# EAGLE design thermometre-v3-main (EAGLE 6.1)
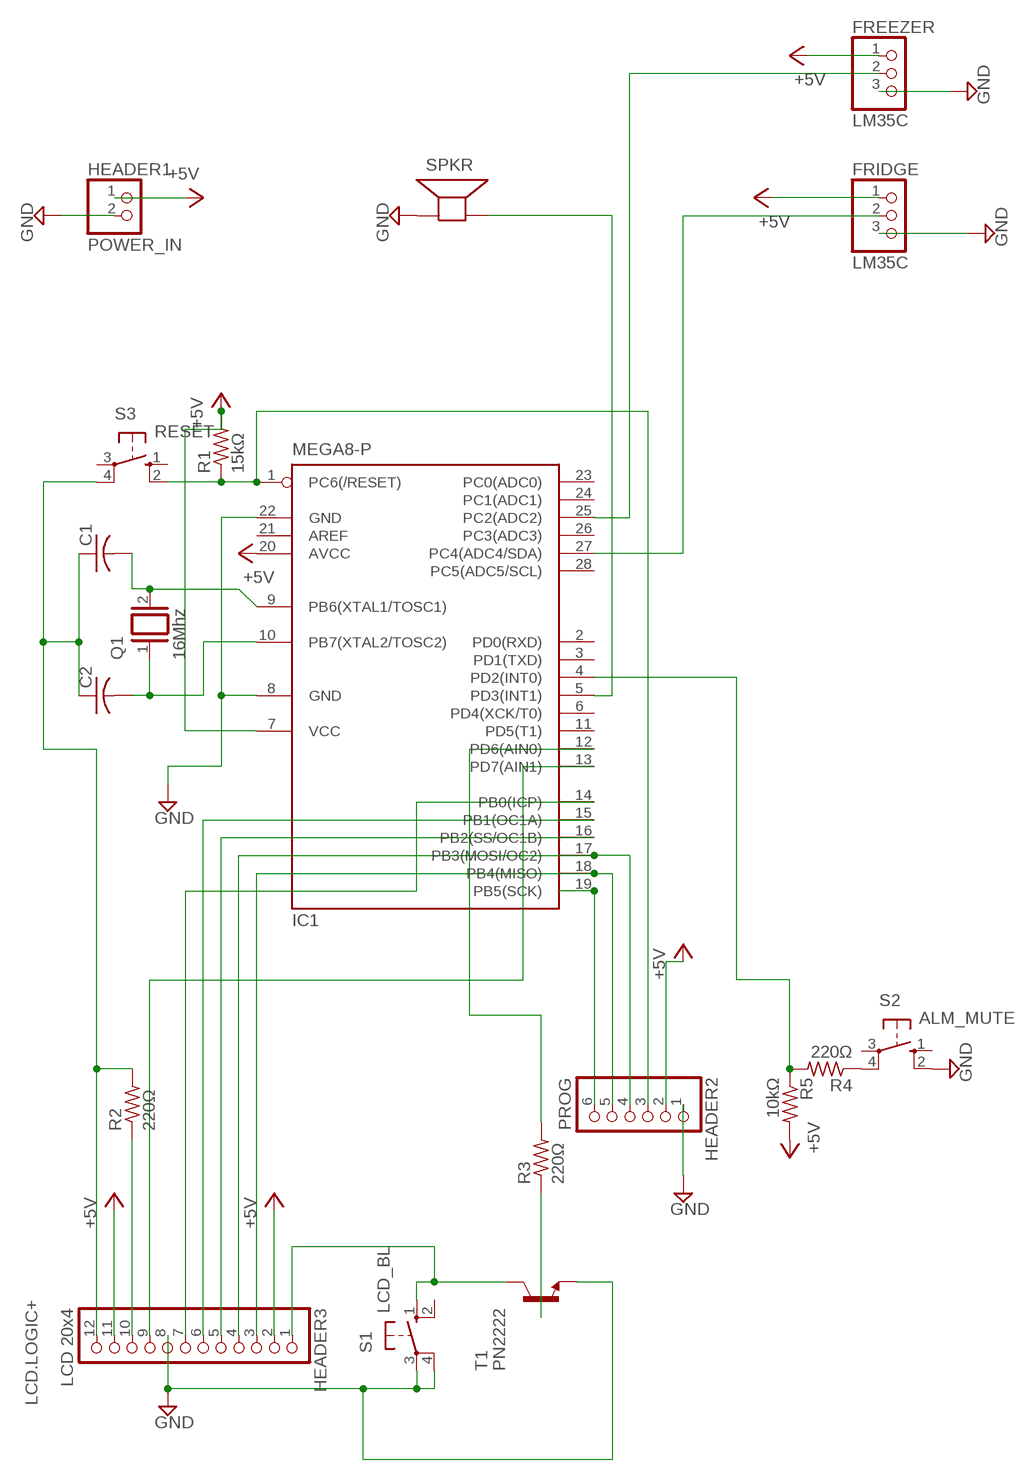
[diagram p0: schematic, sheet 1]

## Parts
C1  C-USC0805  [C0805]
C2  C-USC0805  [C0805]
FREEZER  LM35C  PINHD-1X3  [1X03]
FRIDGE  LM35C  PINHD-1X3  [1X03]
HEADER1  POWER_IN  PINHD-1X2  [1X02]
HEADER2  PROG  PINHD-1X6  [1X06]
HEADER3  LCD 20x4  PINHD-1X12  [1X12]
IC1  MEGA8-P  [DIL28-3]
Q1  16Mhz  XTAL/S  [QS]
R1  15kΩ  R-US_R0805  [R0805]
R2  220Ω  R-US_R0805  [R0805]
R3  220Ω  R-US_R0805  [R0805]
R4  220Ω  R-US_R0805  [R0805]
R5  10kΩ  R-US_R0805  [R0805]
S1  LCD_BL  10-XX  [B3F-10XX]
S2  ALM_MUTE  10-XX  [B3F-10XX]
S3  RESET  10-XX  [B3F-10XX]
SPKR  SPEAKER/AL60P  [AL60P]
T1  PN2222  BC547A-NPN-TO92-CBE  [TO92-CBE]

## Nets
+5V: FREEZER.1 FRIDGE.1 HEADER1.1 HEADER2.2 HEADER3.2 IC1.7(VCC) IC1.20(AVCC) R1.2 R5.2
GND: FREEZER.3 FRIDGE.3 HEADER1.2 HEADER2.1 HEADER3.8 IC1.8(GND) IC1.22(GND) S1.3(P) S1.4(P1) S2.2(S1) SPKR.1(+) T1.E
LCD.BL+: HEADER2.5 HEADER3.3 IC1.18(PB4(MISO))
LCD.BL-: HEADER3.1 S1.1(S) T1.C
LCD.CONTRAST: HEADER3.10 R2.1
LCD.LOGIC+: C1.1 C2.1 HEADER3.12 R2.2 S3.4(P1)
LCD.LOGIC-: HEADER3.11 ; supply symbol labelled +5V
N$1: C1.2 IC1.9(PB6(XTAL1/TOSC1)) Q1.2
N$2: C2.2 IC1.10(PB7(XTAL2/TOSC2)) Q1.1
N$4: HEADER2.3 IC1.1(PC6(/RESET)) R1.1 S3.2(S1)
N$5: HEADER2.6 IC1.19(PB5(SCK))
N$7: HEADER2.4 HEADER3.4 IC1.17(PB3(MOSI/OC2))
N$8: R4.1 S2.4(P1)
N$10: HEADER3.7 IC1.14(PB0(ICP))
N$13: HEADER3.9 IC1.13(PD7(AIN1))
N$14: HEADER3.6 IC1.15(PB1(OC1A))
N$15: HEADER3.5 IC1.16(PB2(SS/OC1B))
N$18: IC1.12(PD6(AIN0)) R3.2
N$20: R3.1 T1.B
N$22: FRIDGE.2 IC1.27(PC4(ADC4/SDA))
N$23: IC1.5(PD3(INT1)) SPKR.2(-)
N$25: IC1.4(PD2(INT0)) R4.2 R5.1
N$28: FREEZER.2 IC1.25(PC2(ADC2))
Unconnected: IC1.2(PD0(RXD)) IC1.3(PD1(TXD)) IC1.6(PD4(XCK/T0)) IC1.11(PD5(T1)) IC1.21(AREF) IC1.23(PC0(ADC0)) IC1.24(PC1(ADC1)) IC1.26(PC3(ADC3)) IC1.28(PC5(ADC5/SCL)) S1.2(S1) S2.1(S) S2.3(P) S3.1(S) S3.3(P)

## Library data of the parts
C1 C2 = rcl:C-US: CAPACITOR, American symbol
FREEZER FRIDGE = pinhead:PINHD-1X3: PIN HEADER
HEADER1 = pinhead:PINHD-1X2: PIN HEADER
HEADER2 = pinhead:PINHD-1X6: PIN HEADER
HEADER3 = pinhead:PINHD-1X12: PIN HEADER
IC1 = atmel:MEGA8-P: MICROCONTROLLER 8 Kbytes FLASH, 1 kbytes SRAM, 512 bytes EEPROM, USART, 4-channel 10 bit ADC, 2-channel 8 bit ADC Pin compatible with Atmega48, ATMega88, ATMega168 Source: avr.lbr; OC_FARNELL: unknown; OC_NEWARK: unknown
Q1 = special:XTAL/S: CRYSTAL
R1 R4 R5 = rcl:R-US_: RESISTOR, American symbol
R2 R3 = resistor:R-US_: RESISTOR, American symbol
S1-S3 = switch-omron:10-XX: OMRON SWITCH; MPN: B3F-1000; OC_FARNELL: 176432; OC_NEWARK: 36M3542
SPKR = adafruit:SPEAKER: SPEAKER Source: Buerklin Added PS12 (for part # PS1240 piezo) http://www.ladyada.net/library/pcb/eaglelibrary.html
T1 = transistor:*-NPN-: NPN Transistror BF959 corrected 2008.03.06

## Board
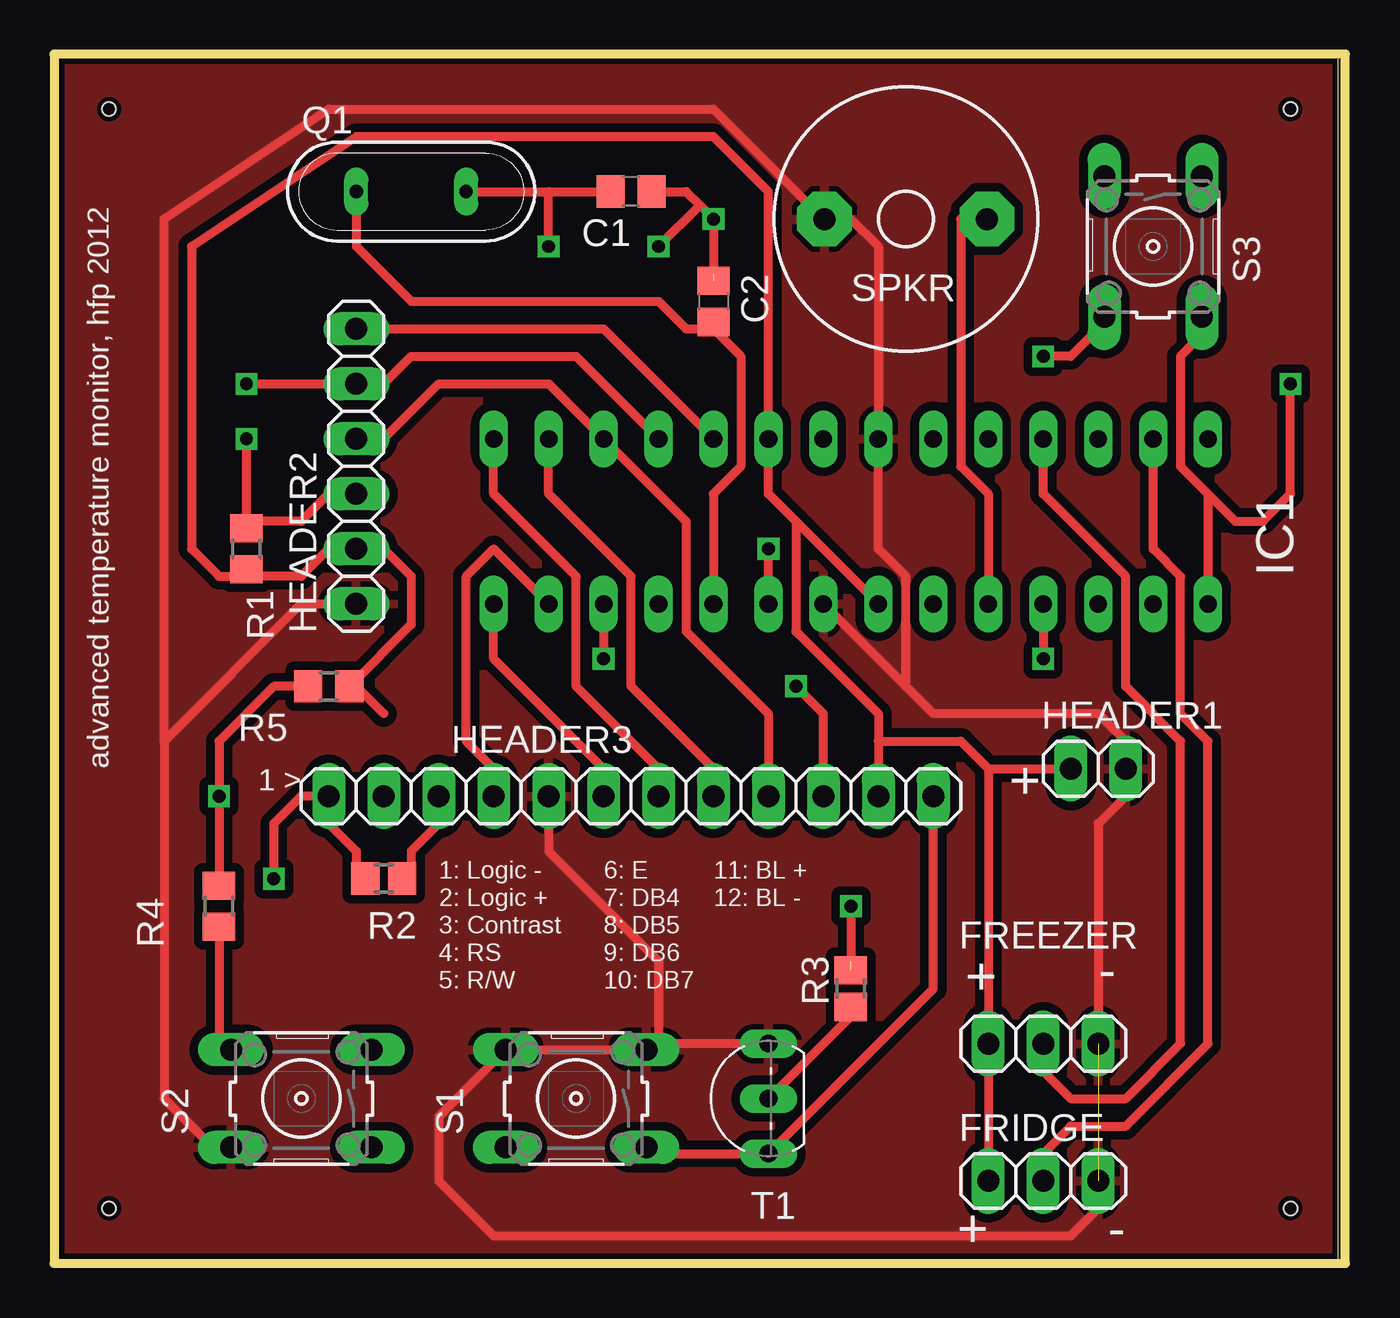
[diagram p1: board, top side]
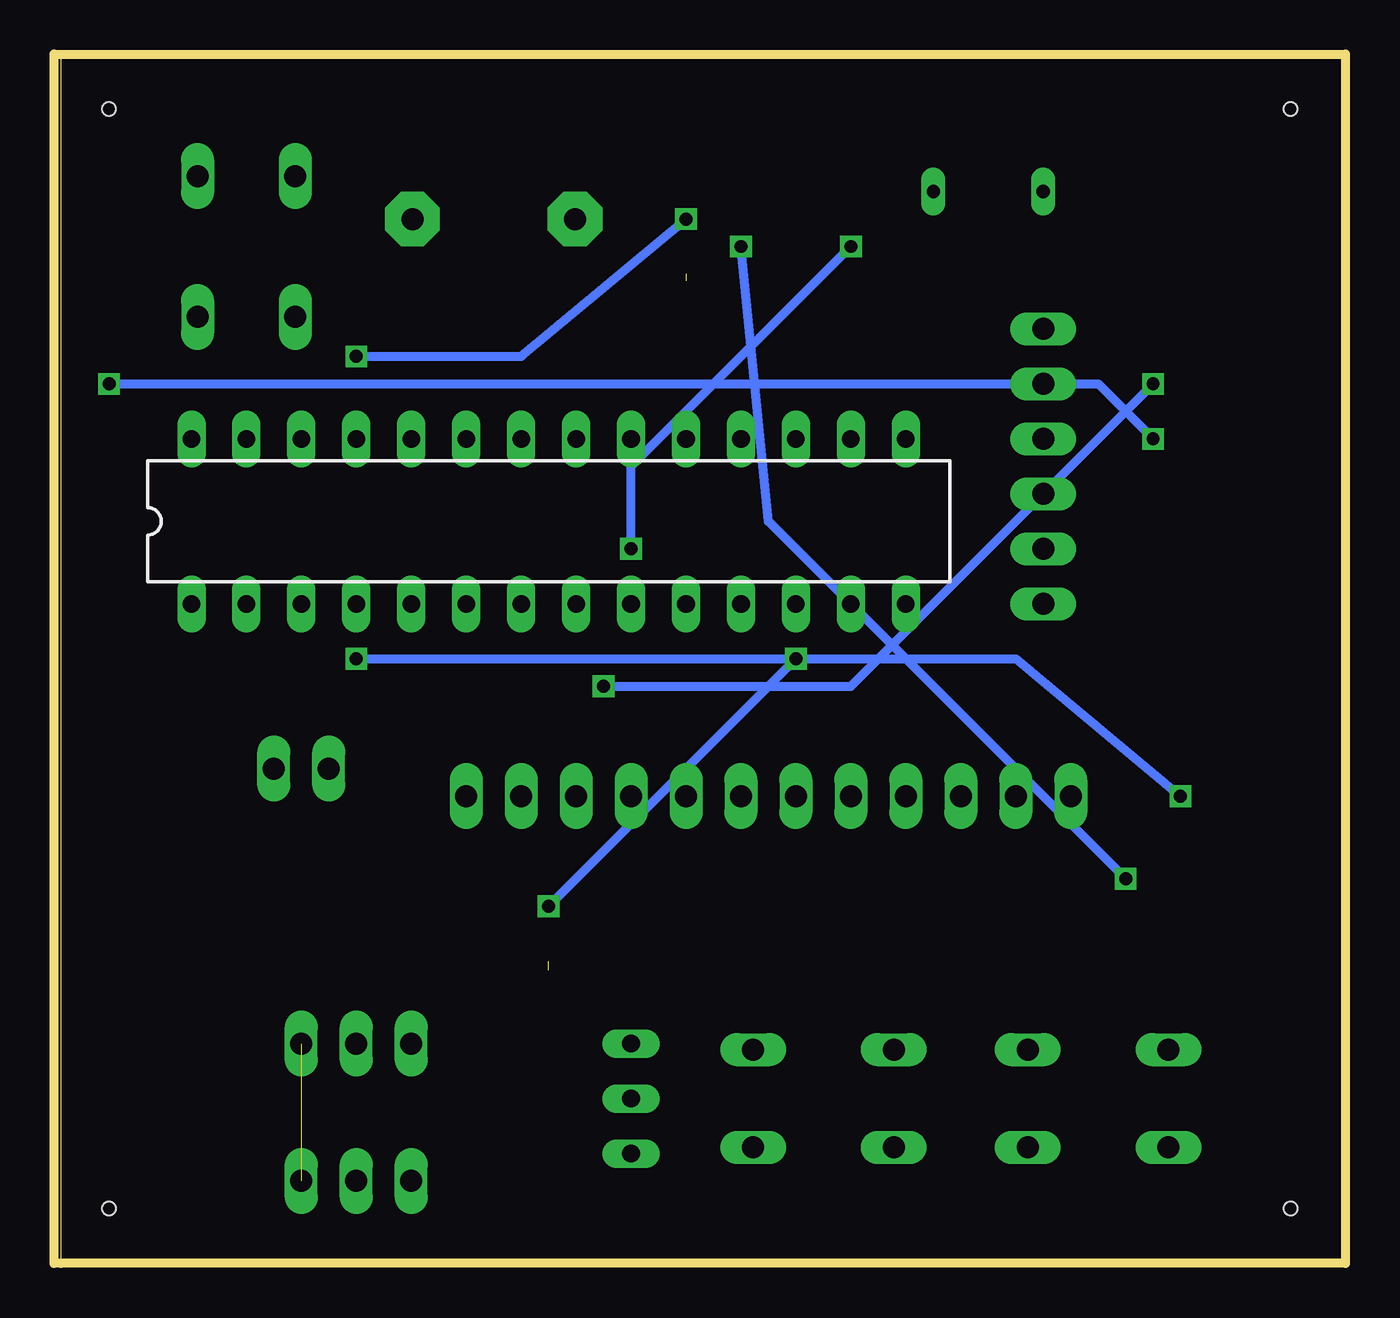
[diagram p2: board, bottom side, seen from below]

Size 59.69 x 55.88 mm. Coordinates in mm from the lower left corner, seen from the top.
Outline: 59.36,0 59.36,55.87 0,55.87
Outline: 59.36,0 0,0 0,55.87
Outline: 59.36,0 59.69,0 59.69,55.88 0,55.88 0,55.87
Copper layers (1*16): Top 0.035mm / dielectric 1.5mm / Bottom 0.035mm
Design rules: minimum track width 16mil, minimum drill 24mil, track to track 16mil, track to pad 16mil, pad to pad 8mil, via to via 8mil, smd to smd 8mil, copper to edge 10mil, drill to drill 8mil, minimum pad ring 10mil, minimum via ring 8mil, stop-mask expansion 4mil, vias tented up to drill 0mil, thermal gap 10mil
Holes 0.6 mm at 57.15,2.54 2.54,2.54 2.54,53.34 57.15,53.34

### Footprints (pad centres in the part's own frame; a part is rotated, then mirrored left to right if it is on the bottom)
C0805 = smd 1.3 x 1.5: 1 -0.95,0; 2 0.95,0
1X03 = drill 1.016 long: 1 -2.54,0; 2 0,0; 3 2.54,0
1X02 = drill 1.016 long: 1 -1.27,0; 2 1.27,0
1X06 = drill 1.016 long: 1 -6.35,0; 2 -3.81,0; 3 -1.27,0; 4 1.27,0; 5 3.81,0; 6 6.35,0
1X12 = drill 1.016 long: 1 -13.97,0; 2 -11.43,0; 3 -8.89,0; 4 -6.35,0; 5 -3.81,0; 6 -1.27,0; 7 1.27,0; 8 3.81,0; 9 6.35,0; 10 8.89,0; 11 11.43,0; 12 13.97,0
DIL28-3 = drill 0.813 long: 1 -16.51,-3.81; 2 -13.97,-3.81; 3 -11.43,-3.81; 4 -8.89,-3.81; 5 -6.35,-3.81; 6 -3.81,-3.81; 7 -1.27,-3.81; 8 1.27,-3.81; 9 3.81,-3.81; 10 6.35,-3.81; 11 8.89,-3.81; 12 11.43,-3.81; 13 13.97,-3.81; 14 16.51,-3.81; 15 16.51,3.81; 16 13.97,3.81; 17 11.43,3.81; 18 8.89,3.81; 19 6.35,3.81; 20 3.81,3.81; 21 1.27,3.81; 22 -1.27,3.81; 23 -3.81,3.81; 24 -6.35,3.81; 25 -8.89,3.81; 26 -11.43,3.81; 27 -13.97,3.81; 28 -16.51,3.81
QS = drill 0.61 long: 1 -2.54,0; 2 2.54,0
R0805 = smd 1.3 x 1.5: 1 -0.95,0; 2 0.95,0
R0805' = smd 1.3 x 1.5: 1 -0.85,0; 2 0.85,0
B3F-10XX = drill 1.016 long: 1 -3.251,2.261; 2 3.251,2.261; 3 -3.251,-2.261; 4 3.251,-2.261
AL60P = drill 1.016 pad 2.54 octagon: 1 -3.759,0; 2 3.759,0
TO92-CBE = drill 0.813 long: B 0,0; C -2.54,0; E 2.54,0

### Placement (x,y rotation side)
C1  26.67,49.53 180 top
C2  30.48,44.45 270 top
FREEZER  45.72,10.16 0 top
FRIDGE  45.72,3.81 0 top
HEADER1  48.26,22.86 0 top
HEADER2  13.97,36.83 90 top
HEADER3  26.67,21.59 180 top
IC1  36.83,34.29 0 bottom
Q1  16.51,49.53 0 top
R1  8.89,33.02 270 top
R2  220Ω  [R0805']  15.24,17.78 180 top
R3  220Ω  [R0805']  36.83,12.7 90 top
R4  7.62,16.51 90 top
R5  12.7,26.67 0 top
S1  24.13,7.62 180 top
S2  11.43,7.62 180 top
S3  50.8,46.99 270 top
SPKR  39.37,48.26 0 top
T1  33.02,7.62 90 top

### Tracks (layer width: path | path; a pad name or v marks a point on that pad's centre or on a via)
+5V
  Top 0.406: 8.89,31.75 11.43,31.75 12.7,33.02 HEADER2.2 15.24,33.02 16.51,31.75 16.51,29.53 R5.2 13.97,26.67 15.24,25.4 | FRIDGE.1 FREEZER.1 43.18,22.86 | IC1.7 34.29,34.29 | 34.29,34.29 33.02,35.56 IC1.20 33.02,49.53 30.48,52.07 13.97,52.07 6.35,46.99 6.35,33.02 7.62,31.75 8.89,31.75 | 38.1,24.13 38.1,25.4 34.29,29.21 34.29,34.29 | 38.1,24.13 HEADER3.2 | 43.18,22.86 HEADER1.1 | 43.18,22.86 41.91,24.13 38.1,24.13 | 8.89,31.75 R1.2
GND  (1 unrouted)
  Top 0.406: 39.37,26.67 40.64,25.4 48.26,25.4 49.53,24.13 HEADER1.2 49.53,21.59 48.26,20.32 FREEZER.3 | 39.37,26.67 IC1.8 | 39.37,26.67 39.37,31.75 38.1,33.02 IC1.22 38.1,46.99 36.83,48.26 SPKR.1 35.56,48.26 30.48,53.34 12.7,53.34 5.08,48.26 5.08,24.13 | FRIDGE.3 48.26,2.54 46.99,1.27 20.32,1.27 17.78,3.81 17.78,6.78 S1.4 S1.3 | HEADER2.1 11.43,30.48 5.08,24.13 | 5.08,24.13 5.08,7.62 7.62,5.08 7.9,5.08 | 7.9,5.08 8.89,5.08 | 7.9,5.08 S2.2 | T1.E 27.66,10.16 S1.3 | HEADER3.8 22.86,19.05 27.94,13.97 27.94,10.44 S1.3
  pour Top: 0,54.61 0,0 59.69,0 59.69,55.88 0,55.88
LCD.BL+  (via drill 0.6)
  Top 0.406: IC1.18 24.13,41.91 16.51,41.91 15.24,40.64 HEADER2.5 v8.89,40.64 | HEADER3.3 35.56,25.4 v34.29,26.67
  Bottom 0.406: v34.29,26.67 22.86,26.67 v8.89,40.64
LCD.BL-
  Top 0.406: S1.1 27.94,5.08 T1.C 40.64,12.7 HEADER3.1
LCD.CONTRAST
  Top 0.406: HEADER3.10 17.78,20.32 16.51,19.05 16.51,17.78 R2.1
LCD.LOGIC+  (via drill 0.6)  (1 unrouted)
  Top 0.406: R2.2 13.97,17.78 13.97,19.05 12.7,20.32 HEADER3.12 11.43,21.59 10.16,20.32 v10.16,17.78 | S3.4 48.54,43.46 46.99,41.91 v45.72,41.91 | C1.1 29.21,49.53 29.84,48.9 | 30.48,45.72 v30.48,48.26 29.84,48.9 | v27.94,46.99 29.84,48.9
  Bottom 0.406: v45.72,41.91 38.1,41.91 v30.48,48.26 | v10.16,17.78 26.67,34.29 v27.94,46.99
N$1  (via drill 0.6)
  Top 0.406: Q1.2 22.86,49.53 | 22.86,49.53 C1.2 | IC1.9 v33.02,33.02 | v22.86,46.99 22.86,49.53
  Bottom 0.406: v33.02,33.02 33.02,36.83 v22.86,46.99
N$2
  Top 0.406: IC1.10 30.48,35.56 31.75,36.83 31.75,41.91 30.48,43.18 C2.2 30.16,43.18 29.21,43.18 27.94,44.45 16.51,44.45 13.97,46.99 Q1.1
N$4  (via drill 0.6)
  Top 0.406: HEADER2.3 12.7,35.56 11.43,34.29 8.89,34.29 R1.1 v8.89,38.1 | 53.34,35.56 IC1.1 | 53.34,35.56 52.07,36.83 52.07,41.91 53.34,43.18 S3.2 | 53.34,35.56 54.61,34.29 55.88,34.29 57.15,35.56 v57.15,40.64
  Bottom 0.406: v57.15,40.64 11.43,40.64 v8.89,38.1
N$5
  Top 0.406: IC1.19 25.4,43.18 HEADER2.6
N$7
  Top 0.406: HEADER2.4 15.24,38.1 17.78,40.64 22.86,40.64 IC1.17 29.21,34.29 29.21,29.21 33.02,25.4 HEADER3.4
N$8
  Top 0.406: R4.1 7.62,10.16 7.9,9.88 S2.4
N$10
  Top 0.406: IC1.14 20.32,27.94 25.4,22.86 HEADER3.7
N$13
  Top 0.406: IC1.13 20.32,33.02 19.05,31.75 19.05,24.13 20.32,22.86 HEADER3.9
N$14
  Top 0.406: IC1.15 20.32,35.56 24.13,31.75 24.13,26.67 27.94,22.86 HEADER3.6
N$15
  Top 0.406: IC1.16 22.86,35.56 26.67,31.75 26.67,26.67 30.48,22.86 HEADER3.5
N$18  (via drill 0.6)  (1 unrouted)
  Top 0.406: IC1.12 v25.4,27.94 | v36.83,16.51 36.83,13.97
  Bottom 0.406: v25.4,27.94 v36.83,16.51
N$20
  Top 0.406: T1.B 36.83,11.43 R3.1
N$22
  Top 0.406: IC1.27 50.8,33.02 52.07,31.75 52.07,25.4 53.34,24.13 53.34,10.16 49.53,6.35 46.99,6.35 45.72,5.08 FRIDGE.2
N$23
  Top 0.406: IC1.5 43.18,35.56 41.91,36.83 41.91,48.26 SPKR.2
N$25  (via drill 0.6)
  Top 0.406: R4.2 v7.62,21.59 7.62,24.13 10.16,26.67 R5.1 | IC1.4 v45.72,27.94
  Bottom 0.406: v45.72,27.94 15.24,27.94 v7.62,21.59
N$28
  Top 0.406: IC1.25 45.72,35.56 49.53,31.75 49.53,26.67 52.07,24.13 52.07,10.16 49.53,7.62 46.99,7.62 45.72,8.89 FREEZER.2

### Text on the board
tPlace: advanced temperature monitor, hfp 2012 | 1 > | + | 1: Logic - | 6: E | 11: BL + | 2: Logic + | 7: DB4 | 12: BL - | 3: Contrast | 8: DB5 | 4: RS | 9: DB6 | + | 5: R/W | 10: DB7 | - | + | -